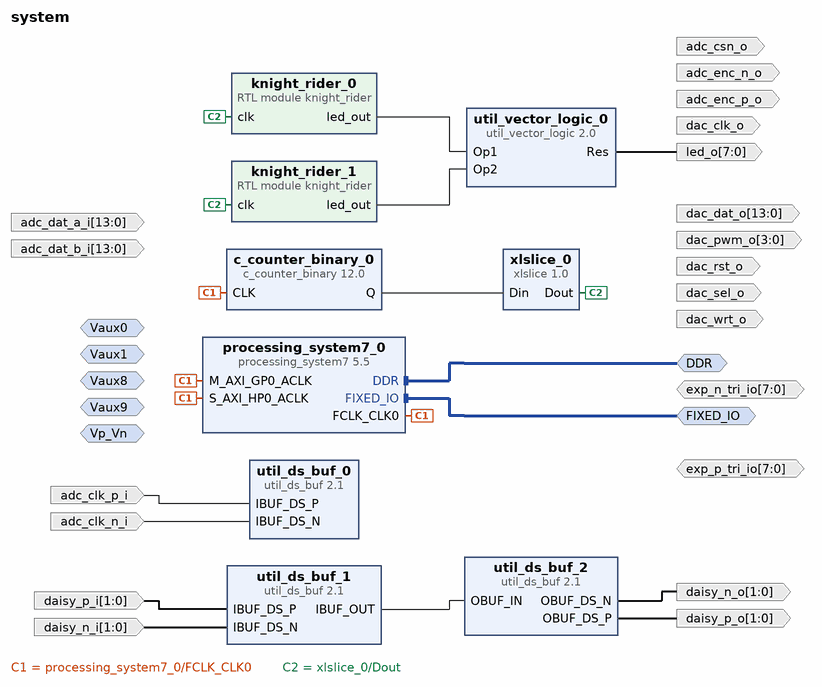
[diagram p0: block diagram of the top level]
# Vivado block design system, xc7z010clg400-1, Vivado 2020.1
create_bd_design system

create_bd_intf_port -mode Slave -vlnv xilinx.com:interface:diff_analog_io_rtl:1.0 Vp_Vn
create_bd_intf_port -mode Slave -vlnv xilinx.com:interface:diff_analog_io_rtl:1.0 Vaux0
create_bd_intf_port -mode Slave -vlnv xilinx.com:interface:diff_analog_io_rtl:1.0 Vaux1
create_bd_intf_port -mode Slave -vlnv xilinx.com:interface:diff_analog_io_rtl:1.0 Vaux9
create_bd_intf_port -mode Slave -vlnv xilinx.com:interface:diff_analog_io_rtl:1.0 Vaux8
create_bd_intf_port -mode Master -vlnv xilinx.com:interface:ddrx_rtl:1.0 DDR
create_bd_intf_port -mode Master -vlnv xilinx.com:display_processing_system7:fixedio_rtl:1.0 FIXED_IO
create_bd_port -dir I -from 13 -to 0 adc_dat_a_i
create_bd_port -dir I -from 13 -to 0 adc_dat_b_i
create_bd_port -dir I adc_clk_p_i
create_bd_port -dir I adc_clk_n_i
create_bd_port -dir O adc_enc_p_o
create_bd_port -dir O adc_enc_n_o
create_bd_port -dir O adc_csn_o
create_bd_port -dir O -from 13 -to 0 dac_dat_o
create_bd_port -dir O dac_clk_o
create_bd_port -dir O dac_rst_o
create_bd_port -dir O dac_sel_o
create_bd_port -dir O dac_wrt_o
create_bd_port -dir O -from 3 -to 0 dac_pwm_o
create_bd_port -dir IO -from 7 -to 0 exp_p_tri_io
create_bd_port -dir IO -from 7 -to 0 exp_n_tri_io
create_bd_port -dir O -from 1 -to 0 daisy_p_o
create_bd_port -dir O -from 1 -to 0 daisy_n_o
create_bd_port -dir I -from 1 -to 0 daisy_p_i
create_bd_port -dir I -from 1 -to 0 daisy_n_i
create_bd_port -dir O -from 7 -to 0 led_o

create_bd_cell -type ip -vlnv xilinx.com:ip:processing_system7:5.5 processing_system7_0
set_property -dict [list \
  CONFIG.PCW_APU_PERIPHERAL_FREQMHZ 666.666666 \
  CONFIG.PCW_ENET0_ENET0_IO {MIO 16 .. 27} \
  CONFIG.PCW_ENET0_GRP_MDIO_ENABLE 1 \
  CONFIG.PCW_ENET0_GRP_MDIO_IO EMIO \
  CONFIG.PCW_ENET0_PERIPHERAL_ENABLE 1 \
  CONFIG.PCW_ENET0_RESET_ENABLE 0 \
  CONFIG.PCW_ENET_RESET_ENABLE 1 \
  CONFIG.PCW_ENET_RESET_SELECT {Share reset pin} \
  CONFIG.PCW_FPGA0_PERIPHERAL_FREQMHZ 125 \
  CONFIG.PCW_FPGA1_PERIPHERAL_FREQMHZ 250 \
  CONFIG.PCW_FPGA3_PERIPHERAL_FREQMHZ 200 \
  CONFIG.PCW_GPIO_MIO_GPIO_ENABLE 1 \
  CONFIG.PCW_GPIO_MIO_GPIO_IO MIO \
  CONFIG.PCW_GPIO_PERIPHERAL_ENABLE 1 \
  CONFIG.PCW_I2C0_GRP_INT_ENABLE 0 \
  CONFIG.PCW_I2C0_I2C0_IO {MIO 50 .. 51} \
  CONFIG.PCW_I2C0_PERIPHERAL_ENABLE 1 \
  CONFIG.PCW_I2C_PERIPHERAL_FREQMHZ 111.111115 \
  CONFIG.PCW_I2C_RESET_ENABLE 1 \
  CONFIG.PCW_I2C_RESET_SELECT {Share reset pin} \
  CONFIG.PCW_IMPORT_BOARD_PRESET cfg/red_pitaya.xml \
  CONFIG.PCW_PRESET_BANK1_VOLTAGE {LVCMOS 2.5V} \
  CONFIG.PCW_QSPI_GRP_SINGLE_SS_ENABLE 1 \
  CONFIG.PCW_QSPI_GRP_SINGLE_SS_IO {MIO 1 .. 6} \
  CONFIG.PCW_QSPI_PERIPHERAL_ENABLE 1 \
  CONFIG.PCW_QSPI_PERIPHERAL_FREQMHZ 125 \
  CONFIG.PCW_QSPI_QSPI_IO {MIO 1 .. 6} \
  CONFIG.PCW_SD0_GRP_CD_ENABLE 1 \
  CONFIG.PCW_SD0_GRP_CD_IO {MIO 46} \
  CONFIG.PCW_SD0_GRP_WP_ENABLE 1 \
  CONFIG.PCW_SD0_GRP_WP_IO {MIO 47} \
  CONFIG.PCW_SD0_PERIPHERAL_ENABLE 1 \
  CONFIG.PCW_SD0_SD0_IO {MIO 40 .. 45} \
  CONFIG.PCW_SDIO_PERIPHERAL_FREQMHZ 100 \
  CONFIG.PCW_SINGLE_QSPI_DATA_MODE x4 \
  CONFIG.PCW_SPI0_PERIPHERAL_ENABLE 1 \
  CONFIG.PCW_SPI0_SPI0_IO EMIO \
  CONFIG.PCW_SPI1_PERIPHERAL_ENABLE 1 \
  CONFIG.PCW_SPI1_SPI1_IO {MIO 10 .. 15} \
  CONFIG.PCW_TTC0_PERIPHERAL_ENABLE 1 \
  CONFIG.PCW_TTC0_TTC0_IO EMIO \
  CONFIG.PCW_UART0_PERIPHERAL_ENABLE 1 \
  CONFIG.PCW_UART0_UART0_IO {MIO 14 .. 15} \
  CONFIG.PCW_UART1_PERIPHERAL_ENABLE 1 \
  CONFIG.PCW_UART1_UART1_IO {MIO 8 .. 9} \
  CONFIG.PCW_UART_PERIPHERAL_FREQMHZ 100 \
  CONFIG.PCW_UIPARAM_DDR_BUS_WIDTH {16 Bit} \
  CONFIG.PCW_UIPARAM_DDR_FREQ_MHZ 533.333333 \
  CONFIG.PCW_UIPARAM_DDR_PARTNO {MT41J256M16 RE-125} \
  CONFIG.PCW_USB0_PERIPHERAL_ENABLE 1 \
  CONFIG.PCW_USB0_RESET_ENABLE 1 \
  CONFIG.PCW_USB0_RESET_IO {MIO 48} \
  CONFIG.PCW_USB0_USB0_IO {MIO 28 .. 39} \
  CONFIG.PCW_USB_RESET_ENABLE 1 \
  CONFIG.PCW_USB_RESET_SELECT {Share reset pin} \
  CONFIG.PCW_USE_S_AXI_HP0 1 \
] [get_bd_cells processing_system7_0]
# 429 more settings of processing_system7_0 are not shown: defaults, MIO pin electricals, DDR timing, and values the tool derives
create_bd_cell -type ip -vlnv xilinx.com:ip:util_ds_buf:2.1 util_ds_buf_0
set_property -dict {CONFIG.C_SIZE 2} [get_bd_cells util_ds_buf_0]
create_bd_cell -type ip -vlnv xilinx.com:ip:util_ds_buf:2.1 util_ds_buf_1
set_property -dict {CONFIG.C_SIZE 2} [get_bd_cells util_ds_buf_1]
create_bd_cell -type ip -vlnv xilinx.com:ip:util_ds_buf:2.1 util_ds_buf_2
set_property -dict {CONFIG.C_BUF_TYPE OBUFDS CONFIG.C_SIZE 2} [get_bd_cells util_ds_buf_2]
create_bd_cell -type ip -vlnv xilinx.com:ip:c_counter_binary:12.0 c_counter_binary_0
set_property -dict {CONFIG.Output_Width 32} [get_bd_cells c_counter_binary_0]
create_bd_cell -type ip -vlnv xilinx.com:ip:xlslice:1.0 xlslice_0
set_property -dict {CONFIG.DIN_FROM 23 CONFIG.DIN_TO 23 CONFIG.DOUT_WIDTH 1} [get_bd_cells xlslice_0]
create_bd_cell -type ip -vlnv xilinx.com:ip:util_vector_logic:2.0 util_vector_logic_0
set_property -dict {CONFIG.C_OPERATION or} [get_bd_cells util_vector_logic_0]
create_bd_cell -type module -reference knight_rider knight_rider_0
set_property -dict {CONFIG.DIR_INIT 0 CONFIG.LEDS_INIT {"0000000011"}} [get_bd_cells knight_rider_0]
create_bd_cell -type module -reference knight_rider knight_rider_1
set_property -dict {CONFIG.DIR_INIT 1 CONFIG.LEDS_INIT {"1100000000"}} [get_bd_cells knight_rider_1]

# ---- connections ----

connect_bd_intf_net [get_bd_intf_ports DDR] [get_bd_intf_pins processing_system7_0/DDR]
connect_bd_intf_net [get_bd_intf_ports FIXED_IO] [get_bd_intf_pins processing_system7_0/FIXED_IO]
connect_bd_net [get_bd_ports adc_clk_p_i] [get_bd_pins util_ds_buf_0/IBUF_DS_P]
connect_bd_net [get_bd_ports adc_clk_n_i] [get_bd_pins util_ds_buf_0/IBUF_DS_N]
connect_bd_net [get_bd_ports daisy_p_i] [get_bd_pins util_ds_buf_1/IBUF_DS_P]
connect_bd_net [get_bd_ports daisy_n_i] [get_bd_pins util_ds_buf_1/IBUF_DS_N]
connect_bd_net [get_bd_pins util_ds_buf_2/OBUF_DS_P] [get_bd_ports daisy_p_o]
connect_bd_net [get_bd_pins util_ds_buf_2/OBUF_DS_N] [get_bd_ports daisy_n_o]
connect_bd_net [get_bd_pins util_ds_buf_1/IBUF_OUT] [get_bd_pins util_ds_buf_2/OBUF_IN]
connect_bd_net [get_bd_pins processing_system7_0/FCLK_CLK0] \
  [get_bd_pins processing_system7_0/M_AXI_GP0_ACLK] [get_bd_pins processing_system7_0/S_AXI_HP0_ACLK] \
  [get_bd_pins c_counter_binary_0/CLK]
connect_bd_net [get_bd_pins c_counter_binary_0/Q] [get_bd_pins xlslice_0/Din]
connect_bd_net [get_bd_pins xlslice_0/Dout] [get_bd_pins knight_rider_0/clk] [get_bd_pins knight_rider_1/clk]
connect_bd_net [get_bd_pins knight_rider_0/led_out] [get_bd_pins util_vector_logic_0/Op1]
connect_bd_net [get_bd_pins knight_rider_1/led_out] [get_bd_pins util_vector_logic_0/Op2]
connect_bd_net [get_bd_pins util_vector_logic_0/Res] [get_bd_ports led_o]

validate_bd_design
save_bd_design
